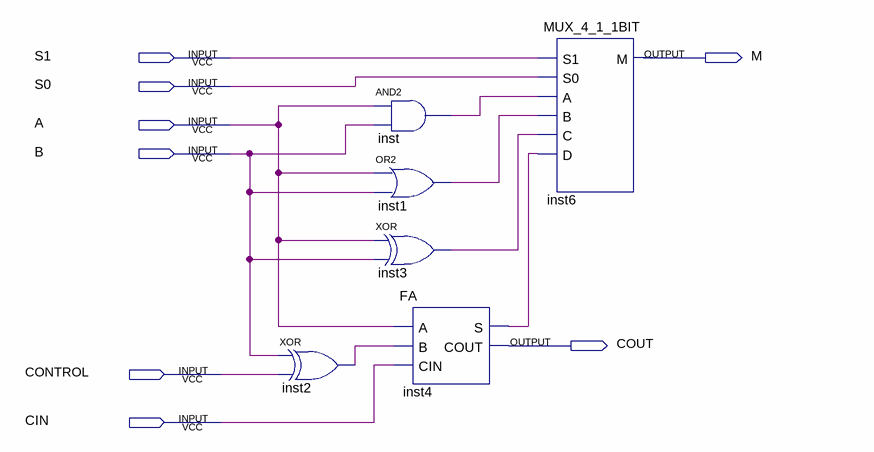
[diagram p0: schematic sheet]
// Quartus schematic ALU_1BIT_4CN.bdf as structural Verilog: 6 symbols, 8 pins
module ALU_1BIT_4CN (
  input  S1,
  input  S0,
  input  A,
  input  B,
  input  CONTROL,
  input  CIN,
  output M,
  output COUT
);

  wire inst1_out, inst2_out, inst3_out, inst4_s, inst_out;

  xor inst2 (inst2_out, B, CONTROL);
  and inst (inst_out, A, B);
  or inst1 (inst1_out, A, B);
  xor inst3 (inst3_out, A, B);
  FA inst4 (.A(A), .B(inst2_out), .CIN(CIN), .S(inst4_s), .COUT(COUT));
  MUX_4_1_1BIT inst6 (.S1(S1), .S0(S0), .A(inst_out), .B(inst1_out), .C(inst3_out), .D(inst4_s));  // open: M
endmodule
